# EAGLE design Low_voltage_motor_driver_v2 (EAGLE 9.6.2)
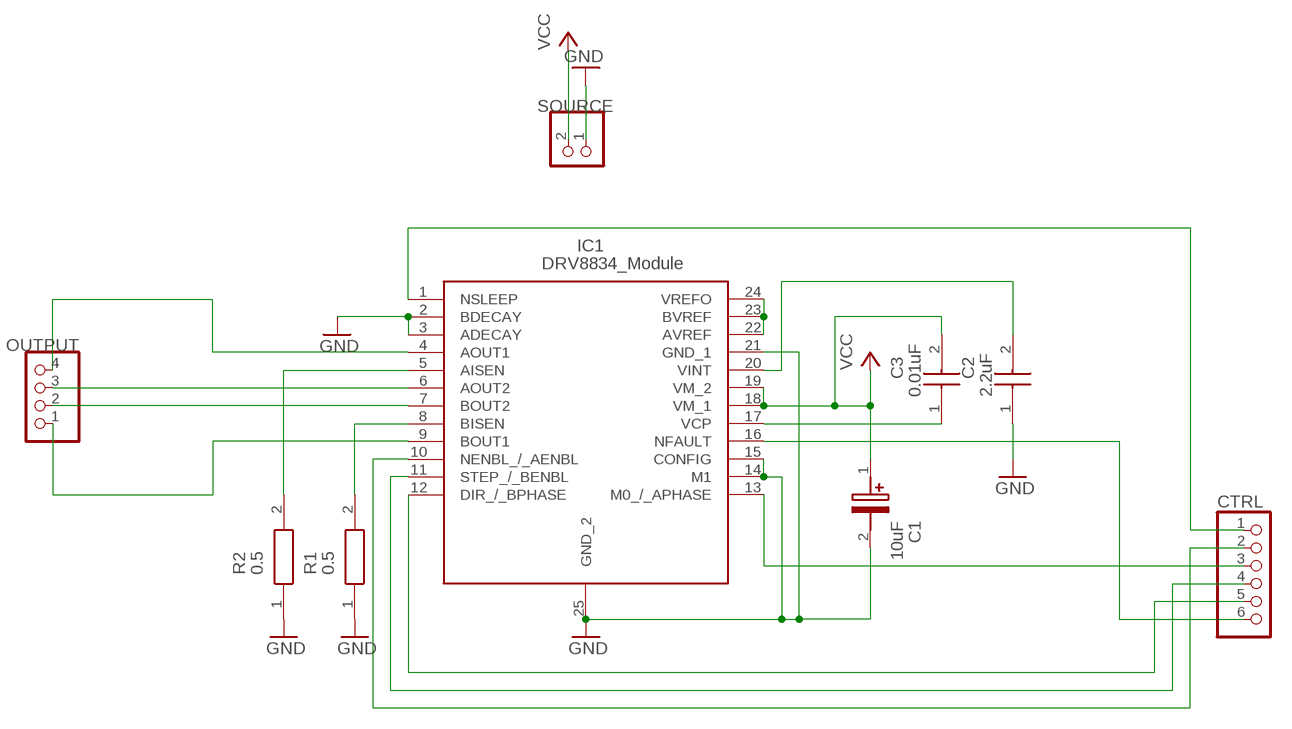
[diagram p0: schematic, sheet 1]

## Parts
C1  10uF  ESL106M050AC3AA  [CAPPRD200W50D500H1250]
C2  2.2uF  C0805C103J4RECAUTO7210  [CAPC2012X88N]
C3  0.01uF  C0805C103J4RECAUTO7210  [CAPC2012X88N]
CTRL  PINHD-1X6  [1X06]
IC1  DRV8834_Module  DRV8834PWPR  [SOP65P640X120-25N]
OUTPUT  PINHD-1X4  [1X04]
R1  0.5  WSL2010R2000DEA  [RESC5125X89N]
R2  0.5  WSL2010R2000DEA  [RESC5125X89N]
SOURCE  PINHD-1X2  [1X02]

## Nets
GND: C1.2(-) C2.1 IC1.2(BDECAY) IC1.3(ADECAY) IC1.14(M1) IC1.15(CONFIG) IC1.21(GND_1) IC1.25(GND_2) R1.1 R2.1 SOURCE.1
N$1: IC1.4(AOUT1) OUTPUT.4
N$2: IC1.6(AOUT2) OUTPUT.3
N$3: IC1.7(BOUT2) OUTPUT.2
N$4: IC1.9(BOUT1) OUTPUT.1
N$5: C3.1 IC1.17(VCP)
N$6: IC1.22(AVREF) IC1.23(BVREF) IC1.24(VREFO)
N$7: C2.2 IC1.20(VINT)
N$8: IC1.5(AISEN) R2.2
N$9: IC1.8(BISEN) R1.2
N$10: CTRL.6 IC1.16(NFAULT)
N$11: CTRL.1 IC1.1(NSLEEP)
N$12: CTRL.2 IC1.10(NENBL_/_AENBL)
N$13: CTRL.3 IC1.13(M0_/_APHASE)
N$14: CTRL.4 IC1.11(STEP_/_BENBL)
N$15: CTRL.5 IC1.12(DIR_/_BPHASE)
VCC: C1.1(+) C3.2 IC1.18(VM_1) IC1.19(VM_2) SOURCE.2

## Library data of the parts
C1 = SamacSys_Parts:ESL106M050AC3AA: Aluminum Electrolytic Capacitors - Radial Leaded 50V 10uF 105C 8k Hour Radial Source: Datasheet; DESCRIPTION: Aluminum Electrolytic Capacitors - Radial Leaded 50V 10uF 105C 8k Hour Radial; HEIGHT: 12.5mm; MANUFACTURER_NAME: Kemet; MANUFACTURER_PART_NUMBER: ESL106M050AC3AA; MOUSER_PART_NUMBER: 80-ESL106M050AC3AA; MOUSER_PRICE-STOCK: https://www.mouser.co.uk/ProductDetail/KEMET/ESL106M050AC3AA?qs=1mbolxNpo8egotXBOUCX3g%3D%3D
C2 C3 = SamacSys_Parts:C0805C103J4RECAUTO7210: Multilayer Ceramic Capacitors MLCC - SMD/SMT 16V 0.01uF X7R 0805 5% AEC-Q200 Source: Datasheet <https://www.kemet.com/specsheet/C0805C103J4RECAUTO7210>; DESCRIPTION: Multilayer Ceramic Capacitors MLCC - SMD/SMT 16V 0.01uF X7R 0805 5% AEC-Q200; HEIGHT: 0.88mm; MANUFACTURER_NAME: Kemet; MANUFACTURER_PART_NUMBER: C0805C103J4RECAUTO7210; MOUSER_PART_NUMBER: 80-C0805C103J4REAULR; MOUSER_PRICE-STOCK: https://www.mouser.co.uk/ProductDetail/KEMET/C0805C103J4RECAUTO7210?qs=55YtniHzbhDvp1eNwhYSCQ%3D%3D
CTRL = pinhead:PINHD-1X6: PIN HEADER
IC1 = SamacSys_Parts:DRV8834PWPR: 2.2A Low Voltage Stepper w/ 32-step Indexer or Dual Brushed DC Motor Driver (Indexer or PH/EN Ctrl) Source: Datasheet <http://www.ti.com/lit/gpn/DRV8834>; DESCRIPTION: 2.2A Low Voltage Stepper w/ 32-step Indexer or Dual Brushed DC Motor Driver (Indexer or PH/EN Ctrl); HEIGHT: 1.2mm; MANUFACTURER_NAME: Texas Instruments; MANUFACTURER_PART_NUMBER: DRV8834PWPR; MOUSER_PART_NUMBER: 595-DRV8834PWPR; MOUSER_PRICE-STOCK: https://www.mouser.co.uk/ProductDetail/Texas-Instruments/DRV8834PWPR?qs=UFc95S4Z4CYJbHHHrd3TVA%3D%3D
OUTPUT = pinhead:PINHD-1X4: PIN HEADER
R1 R2 = SamacSys_Parts:WSL2010R2000DEA: Current Sense Resistors - SMD 1/2watt .2ohms .5% Source: Datasheet; DESCRIPTION: Current Sense Resistors - SMD 1/2watt .2ohms .5%; HEIGHT: 0.889mm; MANUFACTURER_NAME: Vishay; MANUFACTURER_PART_NUMBER: WSL2010R2000DEA
SOURCE = pinhead:PINHD-1X2: PIN HEADER

## Board
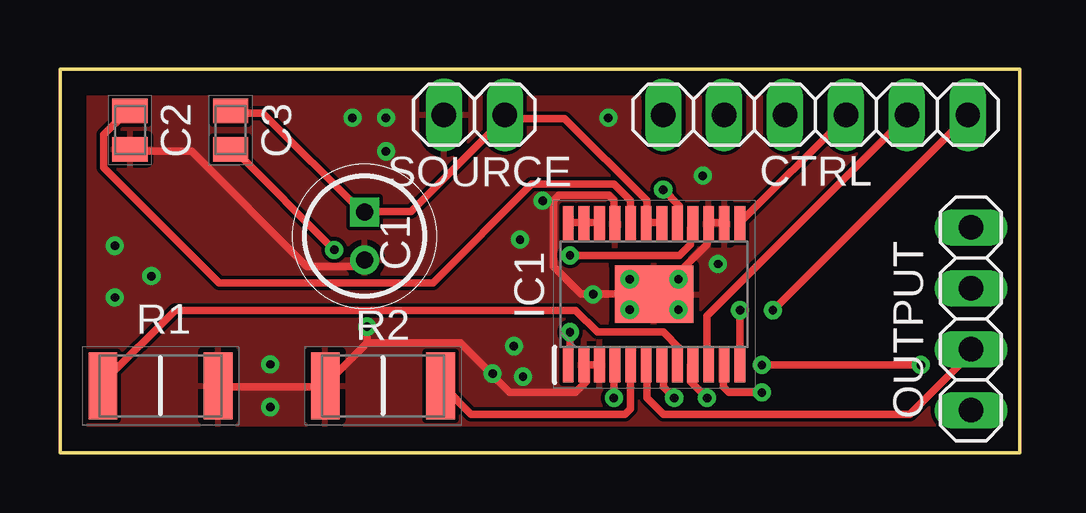
[diagram p1: board, top side]
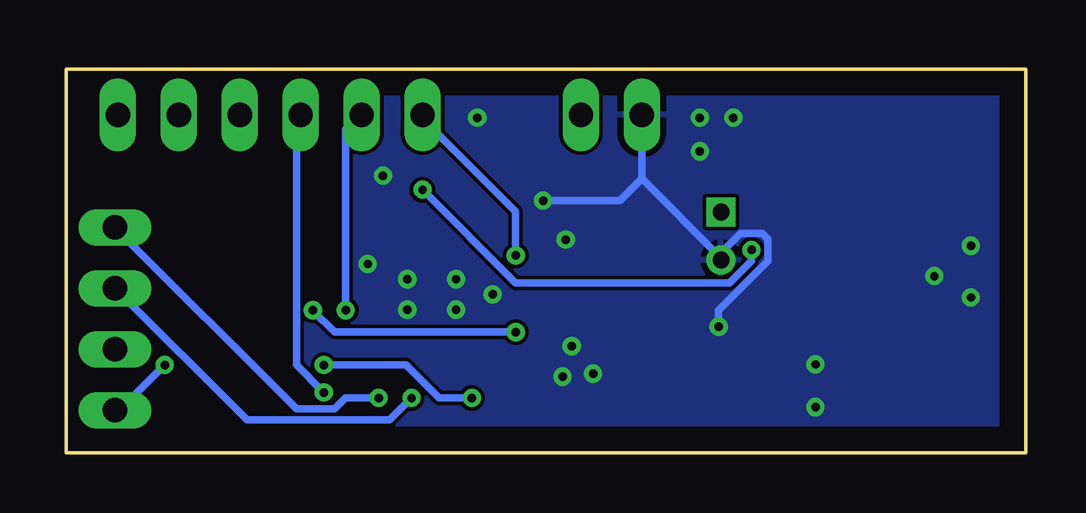
[diagram p2: board, bottom side, seen from below]

Size 40 x 16 mm. Coordinates in mm from the lower left corner, seen from the top.
Outline: 0,16 0,0 40,0 40,16 0,16
Copper layers (1*16): Top 0.035mm / dielectric 1.5mm / Bottom 0.035mm
Design rules "default *": minimum track width 12mil, minimum drill 0.35mm, track to track 6mil, track to pad 6mil, pad to pad 6mil, via to via 6mil, smd to smd 6mil, copper to edge 40mil, drill to drill 6mil, minimum pad ring 10mil, minimum via ring 8mil, stop-mask expansion 4mil, vias tented up to drill 0mil, thermal gap 10mil

### Footprints (pad centres in the part's own frame; a part is rotated, then mirrored left to right if it is on the bottom)
CAPPRD200W50D500H1250 = drill 0.7 pad 1.1 square: 1 0,0 | drill 0.7 pad 1.1: 2 2,0
CAPC2012X88N = smd 1.02 x 1.47: 1 -0.8,0; 2 0.8,0
1X06 = drill 1.016 long: 1 -6.35,0; 2 -3.81,0; 3 -1.27,0; 4 1.27,0; 5 3.81,0; 6 6.35,0
SOP65P640X120-25N = smd 1.475 x 0.45: 1 -2.938,3.575; 2 -2.938,2.925; 3 -2.938,2.275; 4 -2.938,1.625; 5 -2.938,0.975; 6 -2.938,0.325; 7 -2.938,-0.325; 8 -2.938,-0.975; 9 -2.938,-1.625; 10 -2.938,-2.275; 11 -2.938,-2.925; 12 -2.938,-3.575; 13 2.938,-3.575; 14 2.938,-2.925; 15 2.938,-2.275; 16 2.938,-1.625; 17 2.938,-0.975; 18 2.938,-0.325; 19 2.938,0.325; 20 2.938,0.975; 21 2.938,1.625; 22 2.938,2.275; 23 2.938,2.925; 24 2.938,3.575 | smd 2.4 x 3.28: 25 0,0
1X04 = drill 1.016 long: 1 -3.81,0; 2 -1.27,0; 3 1.27,0; 4 3.81,0
RESC5125X89N = smd 1.2 x 2.8: 1 -2.4,0; 2 2.4,0
1X02 = drill 1.016 long: 1 -1.27,0; 2 1.27,0

### Placement (x,y rotation side)
C1  12.7,10.03 270 top
C2  2.92,13.46 90 top
C3  7.11,13.46 90 top
CTRL  31.5,14.1 180 top
IC1  24.77,6.6 90 top
OUTPUT  37.97,5.59 270 top
R1  4.19,2.79 180 top
R2  13.46,2.79 0 top
SOURCE  17.27,14.1 0 top

### Tracks (layer width: path | path; a pad name or v marks a point on that pad's centre or on a via)
GND  (via drill 0.35)
  Top 0.305: 21.95,3.66 22.4,3.66 IC1.3 | 21.95,3.66 21.95,2.97 21.49,2.52 18.75,2.52 16.69,4.57 12.8,4.57 | 12.8,4.57 11.2,2.97 R2.1 10.97,2.74 6.63,2.74 R1.1 | 21.95,3.66 IC1.2 | IC1.14 27.66,9.6 27.2,9.6 IC1.15 26.98,9.37 26.98,8.69 24.92,6.63 IC1.25 24.69,6.63 21.72,6.63 20.57,7.77 20.57,10.52 | 20.57,10.52 20.8,10.74 22.86,10.74 23.09,10.52 23.09,9.6 IC1.21 | C2.1 2.97,12.57 5.49,12.57 10.29,7.77 12.34,7.77 12.57,8 C1.2 | v20.12,10.52 20.57,10.52 | v12.8,5.26 12.8,4.57
  Bottom 0.305: 16,11.43 SOURCE.1 | 12.8,8.23 16,11.43 | v20.12,10.52 16.92,10.52 16,11.43 | v12.8,5.26 12.8,5.94 10.74,8 10.74,8.91 10.97,9.14 11.89,9.14 12.8,8.23 | 12.8,8.23 C1.2
  other vias: 23.75,7.24 23.75,5.97 25.78,7.24 25.78,5.97 22.23,6.6 27.43,7.87 26.8,11.56 19.18,8.89 18.03,3.3 18.92,4.45 19.3,3.17 22.86,13.97 13.59,13.97 13.59,12.57 12.19,13.97 8.76,3.68 8.76,1.91 3.81,7.37 2.29,6.48 2.29,8.64
  pour Top: 0,15.88 0,0 39.88,0 39.88,15.88
  pour Bottom: 0.13,16 0.13,0.13 0.25,0 40.01,0 40.01,15.88 0.25,15.88
N$1  (via drill 0.35)
  Top 0.305: v23.09,2.29 23.09,3.66 IC1.4 | v35.89,3.66 v29.26,3.66
  Top 0.406: 23.11,3.64 IC1.4
  Bottom 0.305: v23.09,2.29 24.46,2.29 25.83,3.66 v29.26,3.66 | v35.89,3.66 37.95,1.6 OUTPUT.4
N$2
  Top 0.305: IC1.6 24.46,3.66 24.46,2.29 25.15,1.6 35.43,1.6 37.95,4.12 OUTPUT.3
N$3  (via drill 0.35)
  Top 0.305: v25.6,2.29 25.15,2.74 25.15,3.66 IC1.7
  Bottom 0.305: v25.6,2.29 26.52,1.37 32.46,1.37 37.95,6.86 OUTPUT.2
N$4  (via drill 0.35)
  Top 0.305: v26.98,2.29 26.29,2.97 26.29,3.66 IC1.9
  Bottom 0.305: v26.98,2.29 28.35,2.29 28.8,1.83 30.4,1.83 OUTPUT.1
N$5  (via drill 0.35)
  Top 0.305: v11.43,8.46 7.32,12.57 C3.1 | v25.15,10.97 25.83,10.29 25.83,9.6 IC1.17
  Bottom 0.305: v11.43,8.46 11.43,8 12.34,7.09 21.26,7.09 v25.15,10.97
N$6
  Top 0.305: IC1.24 21.26,9.6 21.72,9.6 IC1.23 21.95,9.6 22.4,9.6 IC1.22
N$7
  Top 0.305: C2.2 2.74,14.17 1.83,13.26 1.83,11.89 6.63,7.09 15.54,7.09 19.66,11.2 23.09,11.2 23.77,10.52 23.77,9.6 IC1.20
N$8
  Top 0.305: IC1.5 23.77,3.66 23.77,1.83 23.55,1.6 17.14,1.6 16,2.74 R2.2
N$9
  Top 0.305: IC1.8 25.83,3.89 25.83,4.34 25.15,5.03 22.4,5.03 21.49,5.94 4.8,5.94 1.83,2.97 R1.2
N$10  (via drill 0.35)
  Top 0.305: v21.26,8.23 25.83,8.23 26.29,8.69 26.29,9.37 IC1.16
  Bottom 0.305: v21.26,8.23 21.26,10.06 25.15,13.95 CTRL.6
N$11  (via drill 0.35)
  Top 0.305: v21.26,5.03 21.26,3.89 IC1.1 | v29.72,5.94 37.72,13.95 CTRL.1
  Bottom 0.305: v21.26,5.03 28.8,5.03 v29.72,5.94
N$12
  Top 0.305: IC1.10 26.98,3.89 26.98,5.71 35.2,13.95 CTRL.2
N$13
  Top 0.305: IC1.13 28.35,9.6 32.69,13.95 CTRL.3
N$14  (via drill 0.35)
  Top 0.305: v29.26,2.52 27.89,2.52 27.66,2.74 27.66,3.66 IC1.11
  Bottom 0.305: v29.26,2.52 30.4,3.66 30.4,13.95 CTRL.4
N$15  (via drill 0.35)
  Top 0.305: v28.35,5.94 28.35,3.89 IC1.12
  Bottom 0.305: v28.35,5.94 28.35,13.49 27.89,13.95 CTRL.5
VCC
  Top 0.305: C3.2 7.32,14.17 8.46,14.17 12.57,10.06 C1.1 12.8,10.06 14.63,10.06 18.52,13.95 SOURCE.2 18.75,13.95 21.03,13.95 24.46,10.52 24.46,9.6 | 24.46,9.6 24.92,9.6 IC1.18 | 24.46,9.6 IC1.19